# EAGLE design SHIELD_PICO_PTH (EAGLE 9.6.2)
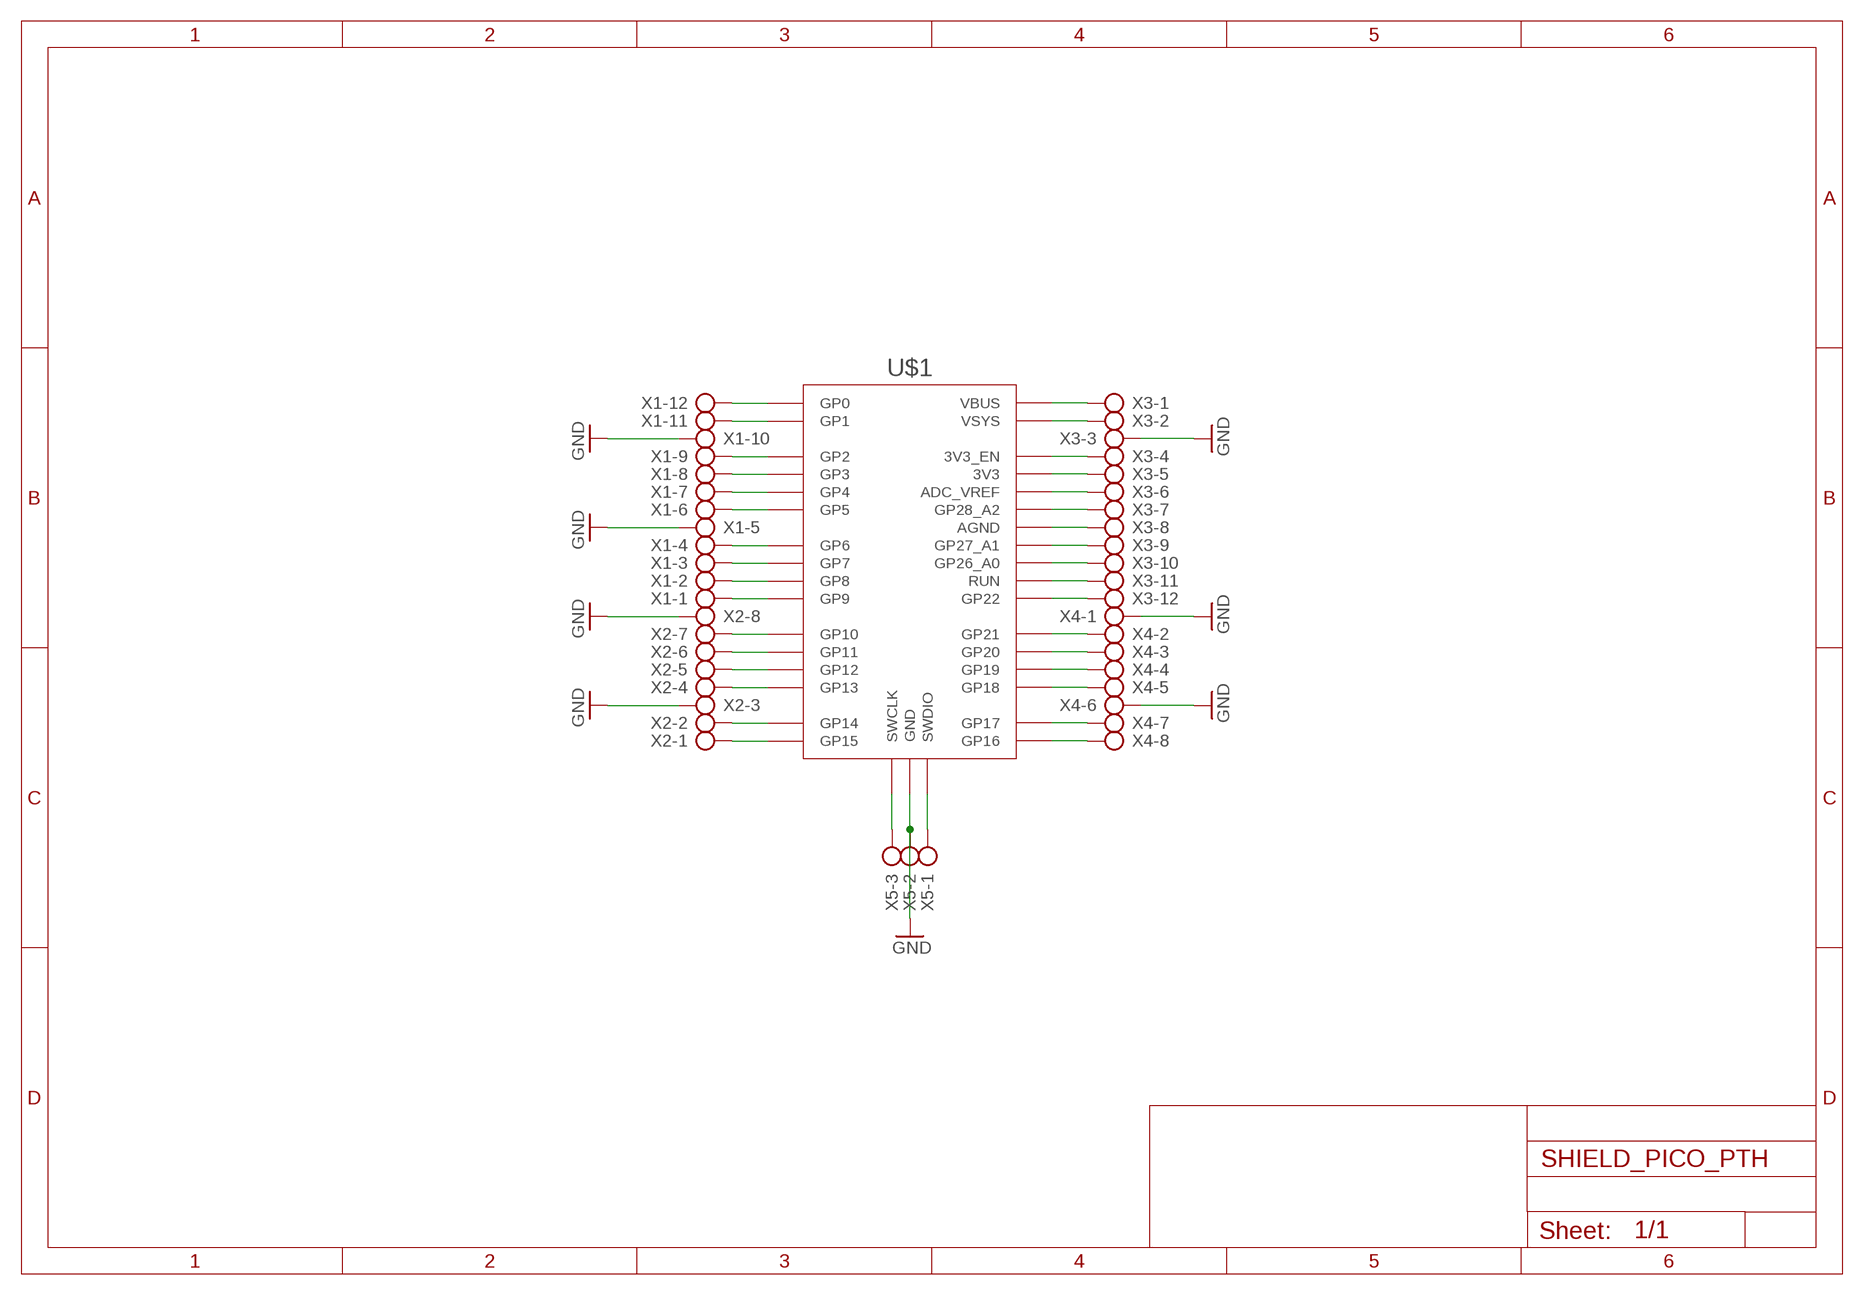
[diagram p0: schematic, sheet 1]

## Parts
U$1  RPI_PICO-TH  [RPI_PICO_TH]
X1  AK300/12  [AK300/12]
X2  AK300/8  [AK300/8]
X3  AK300/12  [AK300/12]
X4  AK300/8  [AK300/8]
X5  AK300/3  [AK300/3]

## Nets
GND: U$1.GND@1(GND) U$1.GND@2(GND) U$1.GND@3(GND) U$1.GND@4(GND) U$1.GND@5(GND) U$1.GND@6(GND) U$1.GND@7(GND) U$1.GND@8(GND) X1.5 X1.10 X2.3 X2.8 X3.3 X4.1 X4.6 X5.2
N$1: U$1.GP0 X1.12
N$2: U$1.GP1 X1.11
N$3: U$1.GP2 X1.9
N$4: U$1.GP3 X1.8
N$5: U$1.GP4 X1.7
N$6: U$1.GP5 X1.6
N$7: U$1.GP6 X1.4
N$8: U$1.GP7 X1.3
N$9: U$1.GP8 X1.2
N$10: U$1.GP9 X1.1
N$11: U$1.GP10 X2.7
N$12: U$1.GP11 X2.6
N$13: U$1.GP12 X2.5
N$14: U$1.GP13 X2.4
N$15: U$1.GP14 X2.2
N$16: U$1.GP15 X2.1
N$18: U$1.SWCLK X5.3
N$19: U$1.SWDIO X5.1
N$20: U$1.VBUS X3.1
N$21: U$1.VSYS X3.2
N$22: U$1.3V3_EN X3.4
N$23: U$1.3V3 X3.5
N$24: U$1.ADC_VREF X3.6
N$25: U$1.GP28_A2 X3.7
N$26: U$1.AGND X3.8
N$27: U$1.GP27_A1 X3.9
N$28: U$1.GP26_A0 X3.10
N$29: U$1.RUN X3.11
N$30: U$1.GP22 X3.12
N$31: U$1.GP21 X4.2
N$32: U$1.GP20 X4.3
N$33: U$1.GP19 X4.4
N$34: U$1.GP18 X4.5
N$35: U$1.GP17 X4.7
N$36: U$1.GP16 X4.8

## Library data of the parts
U$1 = RASPBERRYPI_PICO:RPI_PICO
X1 X3 = con-ptr500:AK300/12: CONNECTOR; OC_FARNELL: unknown; OC_NEWARK: unknown
X2 X4 = con-ptr500:AK300/8: CONNECTOR; OC_FARNELL: unknown; OC_NEWARK: unknown
X5 = con-ptr500:AK300/3: CONNECTOR; OC_FARNELL: unknown; OC_NEWARK: unknown

## Board
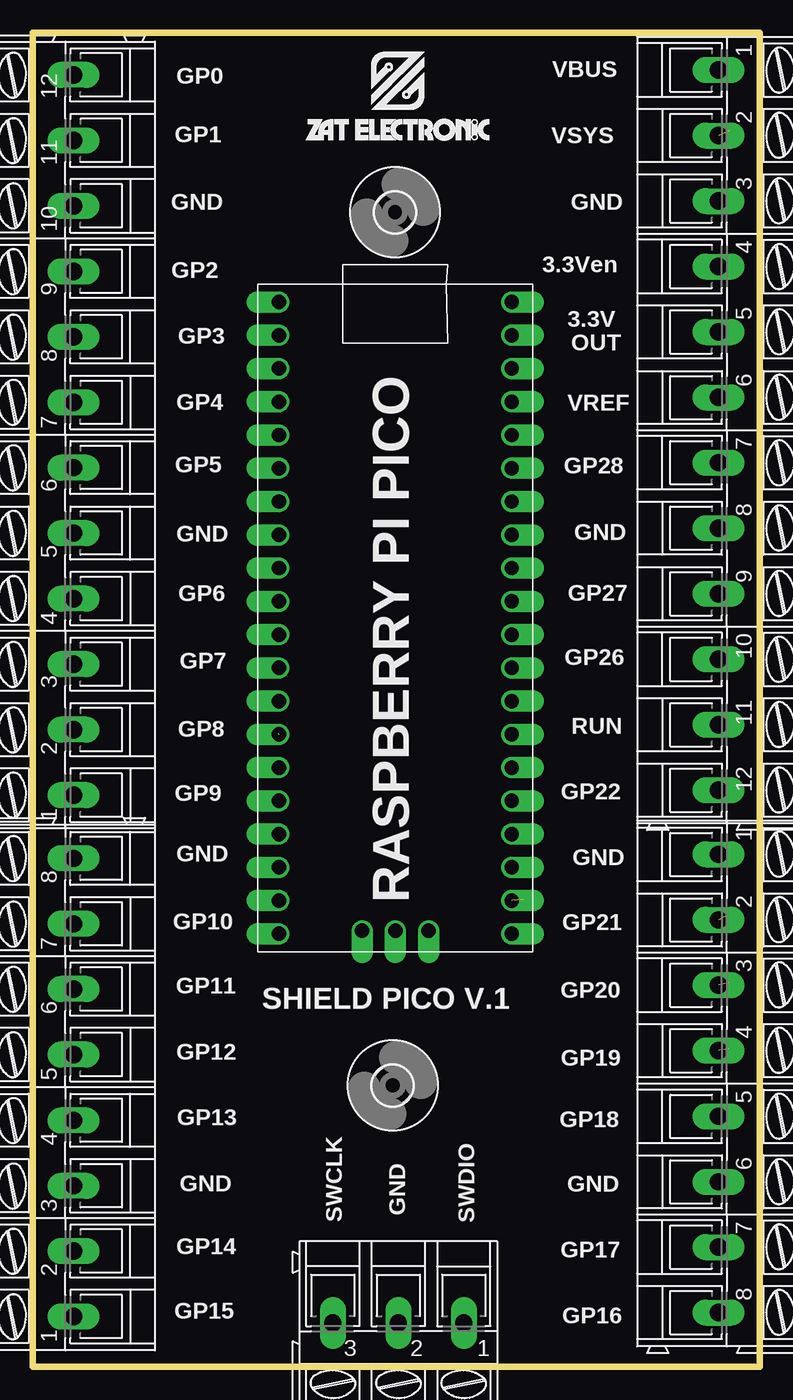
[diagram p1: board, top side]
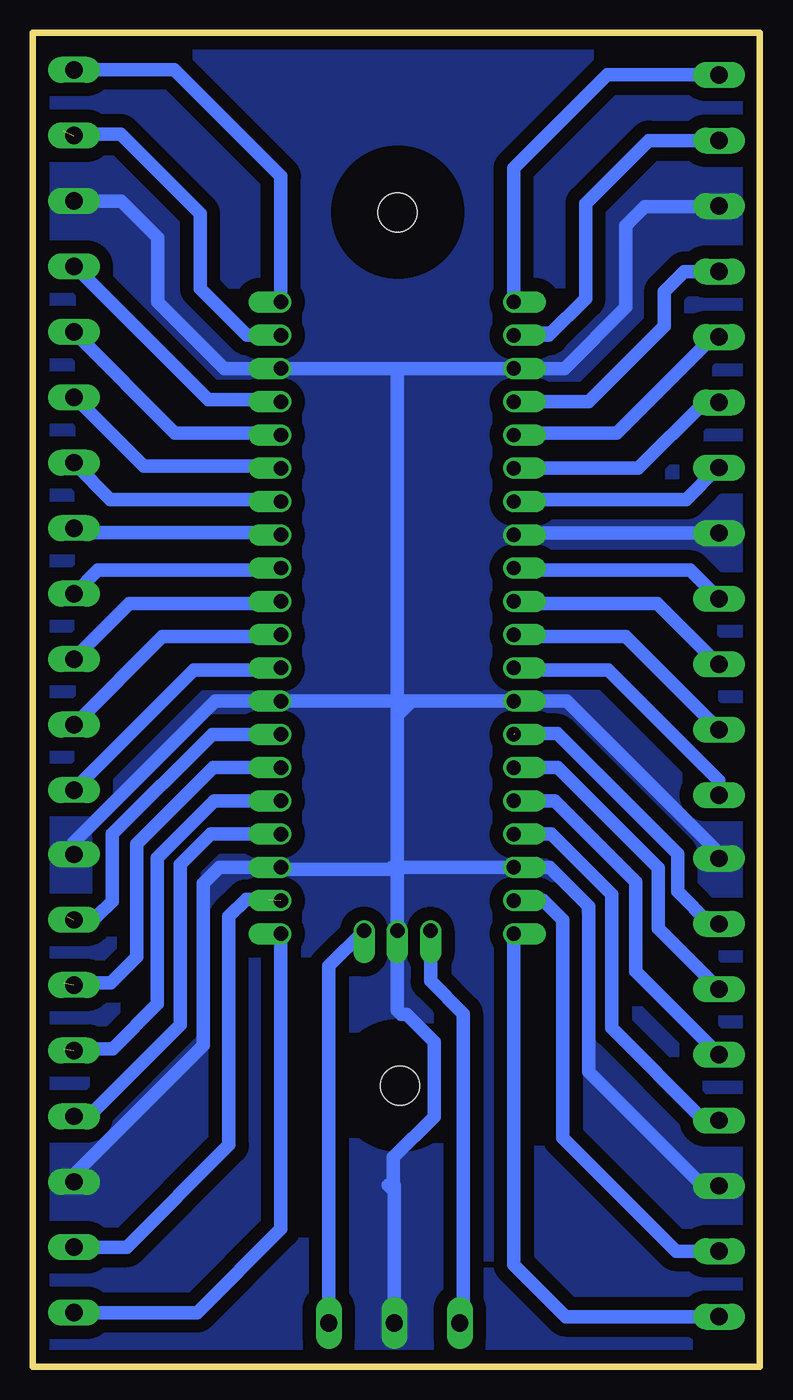
[diagram p2: board, bottom side, seen from below]

Size 55.52 x 101.9 mm. Coordinates in mm from the lower left corner, seen from the top.
Outline: 0,101.9 0,0 55.52,0 55.52,101.9 0,101.9
Copper layers (1*16): Top 0.035mm / dielectric 1.5mm / Bottom 0.035mm
Design rules "default *": minimum track width 40mil, minimum drill 0.35mm, track to track 10mil, track to pad 10mil, pad to pad 10mil, via to via 10mil, smd to smd 40mil, copper to edge 10mil, drill to drill 10mil, minimum pad ring 10mil, minimum via ring 8mil, stop-mask expansion 4mil, vias tented up to drill 0mil, thermal gap 20mil

### Footprints (pad centres in the part's own frame; a part is rotated, then mirrored left to right if it is on the bottom)
RPI_PICO_TH = drill 1.1 pad 1.6 offset: 3V3 8.89,13.97; 3V3_EN 8.89,16.51; ADC_VREF 8.89,11.43; AGND 8.89,6.35; GND@1 -8.89,19.05; GND@2 -8.89,6.35; GND@3 -8.89,-6.35; GND@4 -8.89,-19.05; GND@5 0,-23.9; GND@6 8.89,-19.05; GND@7 8.89,-6.35; GND@8 8.89,19.05; GP0 -8.89,24.13; GP1 -8.89,21.59; GP2 -8.89,16.51; GP3 -8.89,13.97; GP4 -8.89,11.43; GP5 -8.89,8.89; GP6 -8.89,3.81; GP7 -8.89,1.27; GP8 -8.89,-1.27; GP9 -8.89,-3.81; GP10 -8.89,-8.89; GP11 -8.89,-11.43; GP12 -8.89,-13.97; GP13 -8.89,-16.51; GP14 -8.89,-21.59; GP15 -8.89,-24.13; GP16 8.89,-24.13; GP17 8.89,-21.59; GP18 8.89,-16.51; GP19 8.89,-13.97; GP20 8.89,-11.43; GP21 8.89,-8.89; GP22 8.89,-3.81; GP26_A0 8.89,1.27; GP27_A1 8.89,3.81; GP28_A2 8.89,8.89; RUN 8.89,-1.27; SWCLK -2.54,-23.9; SWDIO 2.54,-23.9; VBUS 8.89,24.13; VSYS 8.89,21.59
3,0 = hole 3: 0,0
AK300/12 = drill 1.321 long: 1 -27.508,0; 2 -22.504,0; 3 -17.501,0; 4 -12.497,0; 5 -7.493,0; 6 -2.489,0; 7 2.489,0; 8 7.493,0; 9 12.497,0; 10 17.501,0; 11 22.504,0; 12 27.508,0
AK300/8 = drill 1.321 long: 1 -17.501,0; 2 -12.497,0; 3 -7.518,0; 4 -2.515,0; 5 2.515,0; 6 7.518,0; 7 12.497,0; 8 17.501,0
AK300/3 = drill 1.321 long: 1 -5.004,0; 2 0,0; 3 5.004,0

### Placement (x,y rotation side)
U$1  27.69,57.2 0 top
U$2  [3,0]  27.48,21.49 0 top
U$3  [3,0]  27.66,88.19 0 top
U$4  [LOGO_ESCRITA_MEDIO]  20.62,93.42 0 top
X1  3.12,71.17 90 top
X2  3.12,21.34 90 top
X3  52.37,71.55 270 top
X4  52.37,21.64 270 top
X5  27.91,3.35 180 top

### Tracks (layer width: path | path; a pad name or v marks a point on that pad's centre or on a via)
GND
  Bottom 1.016: 28.36,13.86 28.17,13.67 27.98,13.86 | X5.2 27.92,13.86 27.98,13.86 | X2.3 3.17,13.86 4.39,13.86 13.06,22.53 13.06,35.18 16.03,38.15 U$1.GND@4 | 18.95,37.99 U$1.GND@4 | 27.69,37.81 27.51,37.99 28.27,37.99 | 27.69,37.81 U$1.GND@5 27.69,27.23 27.38,26.92 26.97,26.92 24.87,24.82 24.87,19.1 27.98,15.98 27.98,13.86 | U$1.GND@6 36.42,37.99 28.27,37.99 | 37.05,38.31 U$1.GND@6 | 18.32,38.31 U$1.GND@4 | X1.10 3.24,88.63 8.78,88.63 10.24,87.17 10.24,80.92 14.91,76.25 U$1.GND@1 27.92,76.25 | 27.69,37.81 27.69,49.73 | 26.57,50.85 U$1.GND@3 14.73,50.85 3.12,39.24 X2.8 | 27.69,49.73 26.57,50.85 | U$1.GND@4 28.11,38.15 28.27,37.99 | X3.3 48.77,89.05 45.97,86.26 45.97,81.33 40.89,76.25 U$1.GND@8 27.92,76.25 | 27.69,49.73 27.69,76.02 27.92,76.25 | 26.57,50.85 U$1.GND@7 41.58,50.85 52.38,40.06 X4.1 | X1.5 18.67,63.68 U$1.GND@2 | U$1.GND@6 41.3,38.15 42.52,36.93 42.52,24.54 53.16,13.89 53.16,14.3
  pour Bottom (isolate 1.016, no thermals): 2.41,102.06 0.03,102.06 0.03,101.8 0.03,0.2 55.27,0.2 55.27,101.93 2.82,101.93 0.69,101.93
N$1
  Bottom 1.016: U$1.GP0 18.8,91.54 11.66,98.68 X1.12
N$2
  Bottom 1.016: 16.1,78.95 18.64,78.95 U$1.GP1 16.1,78.79 13.31,81.58 13.31,88.85 8.48,93.67 X1.11 3.24,93.55
N$3
  Bottom 1.016: 18.64,73.87 U$1.GP2 13.08,73.71 7.31,79.48 7.31,82.12 5.77,83.67 X1.9
N$4
  Bottom 1.016: U$1.GP3 18.64,71.33 10.95,71.33 3.8,78.48 X1.8
N$5
  Bottom 1.016: X1.7 4.24,73.66 9.27,68.63 U$1.GP4
N$6
  Bottom 1.016: U$1.GP5 18.64,66.25 5.62,66.25 3.24,68.63 X1.6
N$7
  Bottom 1.016: U$1.GP6 18.64,60.85 5.3,60.85 X1.4
N$8
  Bottom 1.016: U$1.GP7 18.64,58.31 7.84,58.31 3.24,53.71 X1.3
N$9
  Bottom 1.016: U$1.GP8 18.64,55.77 10.22,55.77 3.24,48.79 X1.2
N$10
  Bottom 1.016: U$1.GP9 18.64,53.23 11.57,53.23 3.12,44.79 X1.1
N$11  (1 unrouted)
  Bottom 1.016: X2.7 3.81,33.83 6.29,36.31 6.29,39.17 15.49,48.37 18.74,48.37
N$12
  Bottom 1.016: X2.6 7.75,33.48 7.75,38.1 15.42,45.77 U$1.GP11
N$13
  Bottom 1.016: U$1.GP12 15.67,43.23 9.47,37.03 9.47,30.2 X2.5
N$14
  Bottom 1.016: U$1.GP13 15.93,40.69 11.33,36.09 11.33,25.88 4.27,18.82 X2.4
N$15
  Bottom 1.016: 18.64,35.45 U$1.GP14 16.54,35.61 15.06,34.14 15.06,17.5 6.4,8.84 X2.2
N$16
  Bottom 1.016: U$1.GP15 18.8,7.8 14.83,3.84 X2.1
N$18
  Bottom 1.016: U$1.SWCLK 25.15,29.46 22.66,26.97 22.66,3.61 X5.3
N$19
  Bottom 1.016: U$1.SWDIO 32.92,30.61 X5.1
N$20
  Bottom 1.016: U$1.VBUS 36.58,90.93 44.7,99.06 X3.1
N$21  (1 unrouted)
  Bottom 1.016: 36.73,78.95 U$1.VSYS 39.17,78.79 42.75,82.37 42.75,88.09 48.82,94.16 53.21,94.16 53.21,94.41 | 52.29,94.03 X3.2
N$22
  Bottom 1.016: U$1.3V3_EN 36.73,73.87 42.13,73.87 52.29,84.03 X3.4
N$23
  Bottom 1.016: U$1.3V3 36.73,71.33 44.67,71.33 52.29,78.95 X3.5
N$24
  Bottom 1.016: U$1.ADC_VREF 36.73,68.79 47.05,68.79 52.29,74.03 X3.6
N$25
  Bottom 1.016: U$1.GP28_A2 36.73,66.25 49.59,66.25 52.29,68.95 X3.7
N$26
  Bottom 1.016: U$1.AGND 36.73,63.71 51.97,63.71 52.29,64.03 X3.8
N$27
  Bottom 1.016: U$1.GP27_A1 36.73,60.85 50.55,60.85 52.29,59.11 X3.9
N$28
  Bottom 1.016: U$1.GP26_A0 36.73,58.31 48.17,58.31 52.29,54.18 X3.10
N$29
  Bottom 1.016: U$1.RUN 36.73,55.77 45.62,55.77 52.29,49.1 X3.11
N$30
  Bottom 1.016: U$1.GP22 36.73,53.23 43.24,53.23 52.29,44.18 X3.12
N$31  (1 unrouted)
  Bottom 1.016: U$1.GP21 41.83,48.31 49.45,40.69 49.45,35.56 50.62,34.39 52.88,34.39
N$32  (1 unrouted)
  Bottom 1.016: U$1.GP20 41.76,45.77 47.6,39.93 47.6,31.32 49.58,29.34 53.16,29.34
N$33  (1 unrouted)
  Bottom 1.016: U$1.GP19 41.66,43.23 46,38.89 46,27.71 49.43,24.28 53.16,24.28
N$34
  Bottom 1.016: U$1.GP18 41.94,40.69 44.27,38.35 44.27,26.11 51.26,19.13 X4.5
N$35  (1 unrouted)
  Bottom 1.016: X4.7 48.34,9.14 40.54,16.94 40.54,34.39 39.22,35.71 37.49,35.71
N$36
  Bottom 1.016: U$1.GP16 36.58,10.54 42.98,4.14 X4.8

### Text on the board
tNames: VBUS | GP0 | VSYS | GP1 | GND | GND | GP2 | 3.3Ven | 3.3V | GP3 | OUT | GP4 | VREF | GP5 | GP28 | GND | GND | GP6 | GP27 | GP7 | GP26 | GP8 | RUN | GP9 | GP22 | GND | GND | RASPBERRY PI PICO | GP10 | GP21 | GP11 | GP20 | SHIELD PICO V.1 | GP12 | GP19 | GP13 | GP18 | GND | GND | GND | SWCLK | SWDIO | GP14 | GP17 | GP15 | GP16